# Altium project Juricic_Ivan.PrjPcb
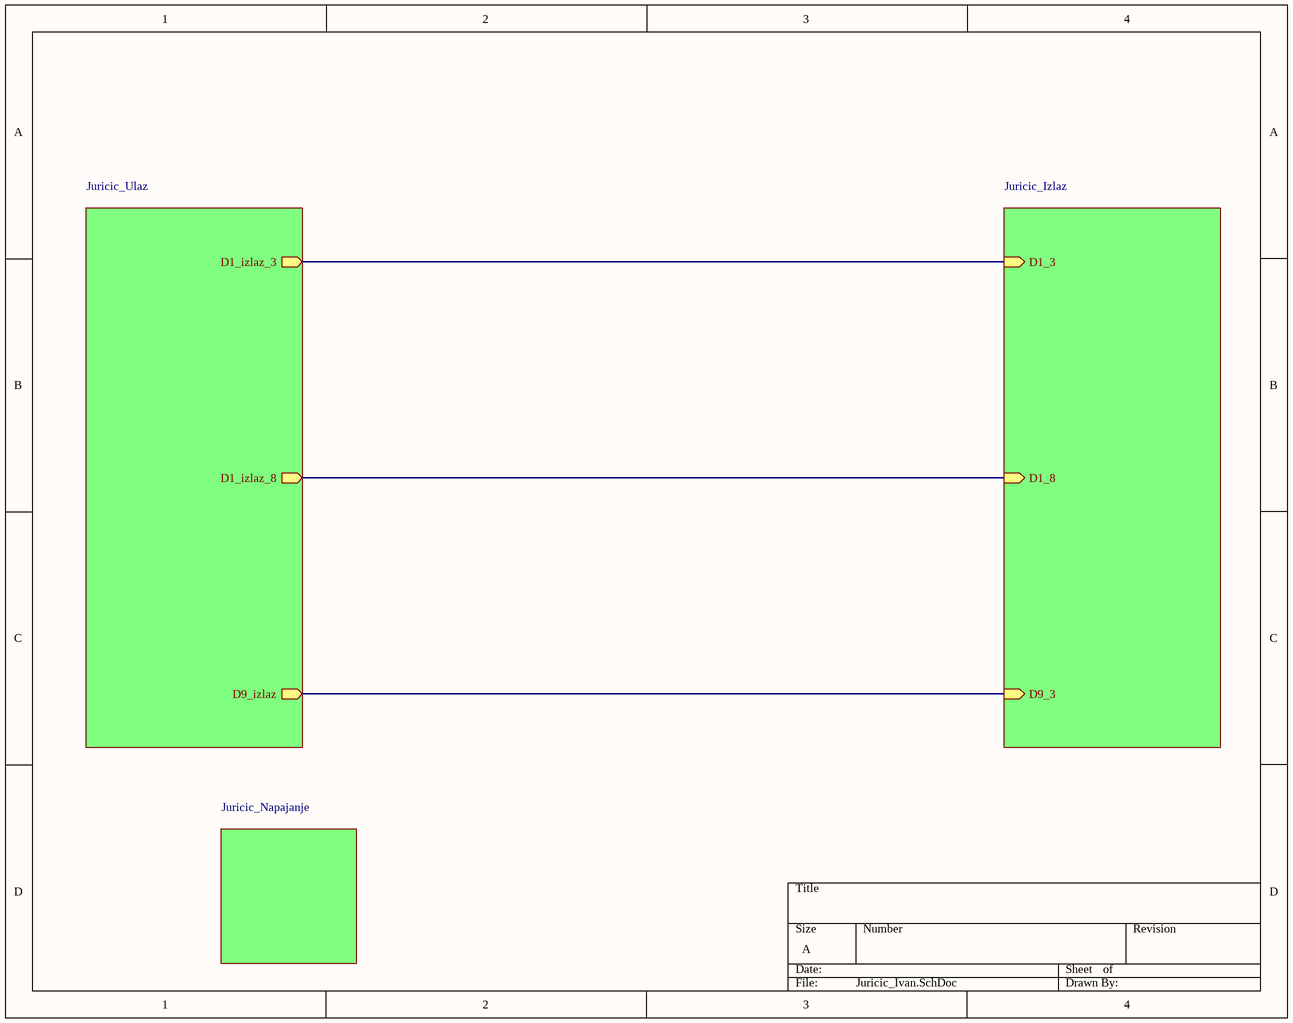
[diagram p0: Juricic_Ivan.SchDoc]
4 sheets, 59 parts. Net scope: hierarchical (ports join the sheet entries above them; power ports are global).
Board file: Juricic_Ivan.PcbDoc
Sheets:
  Juricic_Ivan.SchDoc
    Juricic_Ulaz = Juricic_Ulaz.SchDoc
    Juricic_Izlaz = Juricic_Izlaz.SchDoc
    Juricic_Napajanje = Juricic_Napajanje.SchDoc

## Sheet Juricic_Ivan.SchDoc
size A

### Sub-sheets
Juricic_Izlaz = Juricic_Izlaz: D1_3 (in), D1_8 (in), D9_3 (in)
Juricic_Napajanje = Juricic_Napajanje: no entries
Juricic_Ulaz = Juricic_Ulaz: D9_izlaz (out), D1_izlaz_8 (out), D1_izlaz_3 (out)

### Nets
D1_8: sheet Juricic_Ulaz/D1_izlaz_8, sheet Juricic_Izlaz/D1_8
D9_3: sheet Juricic_Ulaz/D9_izlaz, sheet Juricic_Izlaz/D9_3
NetD1_3: sheet Juricic_Ulaz/D1_izlaz_3, sheet Juricic_Izlaz/D1_3

## Sheet Juricic_Ulaz.SchDoc
size A
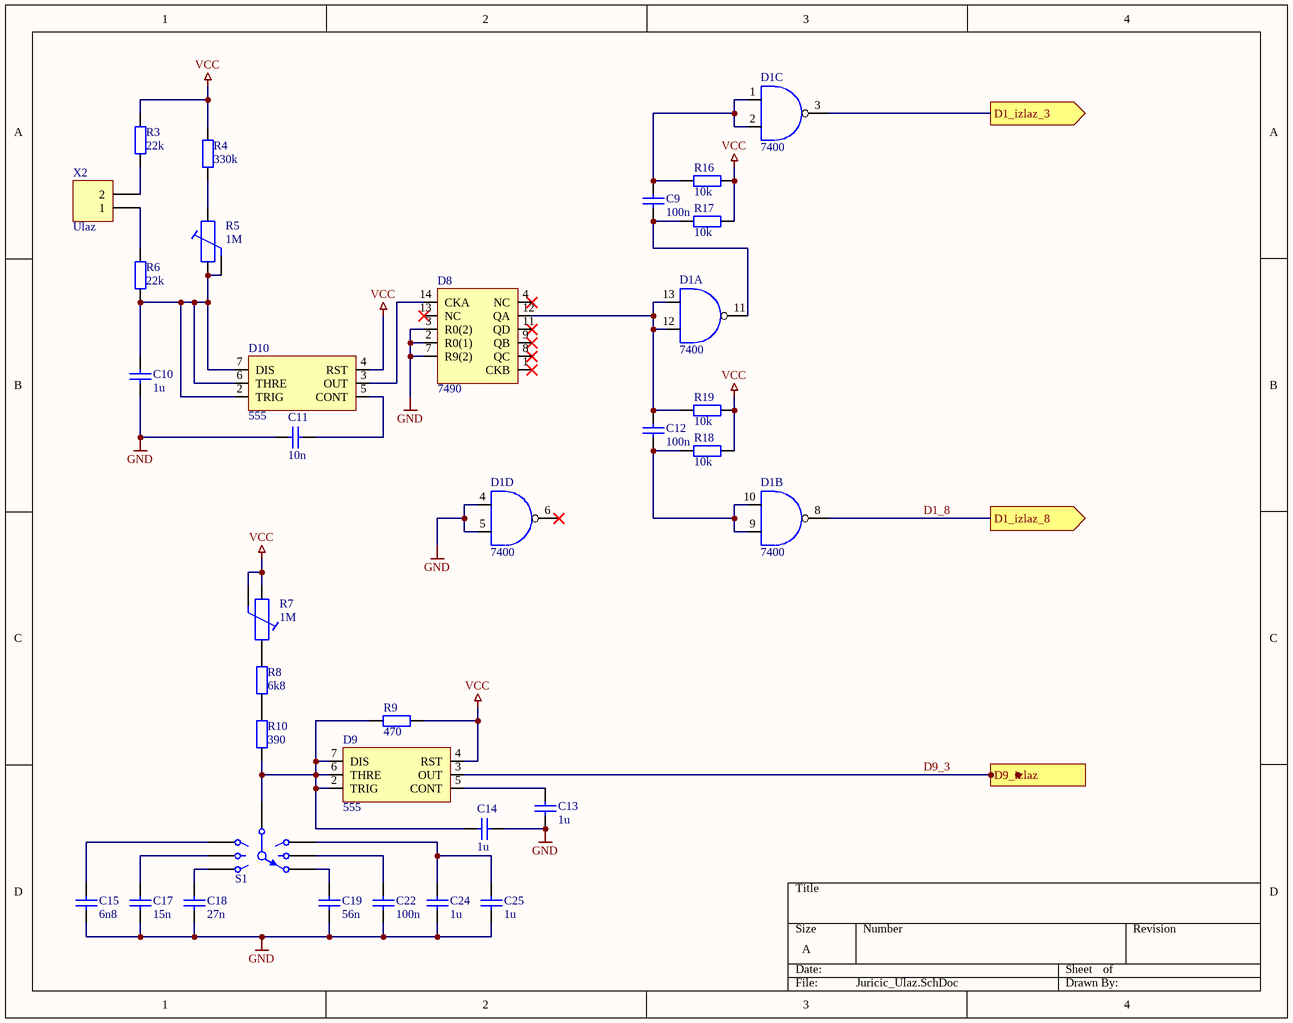
[diagram p1: Juricic_Ulaz.SchDoc]

### Parts
C9  100n  [C0805]
C10  1u  [C0805]
C11  10n  [C0805]
C12  100n  [C0805]
C13  1u  [C0805]
C14  1u  [C0805]
C15  6n8  [C0805]
C17  15n  [C0805]
C18  27n  [C0805]
C19  56n  [C0805]
C22  100n  [C0805]
C24  1u  [C0805]
C25  1u  [C0805]
D1  7400  [DIP-14]  (parts A,B,C,D of 4)
D8  7490  [DIP-14]
D9  555  [DIP-8]
D10  555  [DIP-8]
R3  22k  [AXIAL-0.4]
R4  330k  [AXIAL-0.4]
R5  1M  [Trimmer]
R6  22k  [AXIAL-0.4]
R7  1M  [Trimmer]
R8  6k8  [AXIAL-0.4]
R9  470  [AXIAL-0.4]
R10  390  [AXIAL-0.4]
R16  10k  [AXIAL-0.4]
R17  10k  [AXIAL-0.4]
R18  10k  [AXIAL-0.4]
R19  10k  [AXIAL-0.4]
S1  SW-6WAY  [SW-7]  (value not drawn)
X2  Ulaz  [HDR1X2]

### Ports
D1_izlaz_3 (out), D1_izlaz_8 (out), D9_izlaz (out)

### Nets
GND: C10.1 C11.2 C13.2 C14.1 C15.1 C17.1 C18.1 C19.1 C22.1 C24.1 C25.1 D1.4 D1.5 D8.2(R0(1)) D8.3(R0(2)) D8.7(R9(2))
VCC: D9.4(RST) D10.4(RST) R3.2 R4.2 R7.2 R7.3 R9.2 R16.2 R17.2 R18.2 R19.2
D1_8: D1.8 ; port D1_izlaz_8
D9_3: D9.3(OUT) ; port D9_izlaz
NetC9_1: C9.1 D1.11 R17.1
NetC9_2: C9.2 D1.1 D1.2 R16.1
NetC10_2: C10.2 D10.2(TRIG) D10.6(THRE) D10.7(DIS) R5.2 R5.3 R6.2
NetC11_1: C11.1 D10.5(CONT)
NetC12_1: C12.1 D1.9 D1.10 R18.1
NetC12_2: C12.2 D1.12 D1.13 D8.12(QA) R19.1
NetC13_1: C13.1 D9.5(CONT)
NetC14_2: C14.2 D9.2(TRIG) D9.6(THRE) D9.7(DIS) R9.1 R10.2 S1.7
NetC15_2: C15.2 S1.1
NetC17_2: C17.2 S1.2
NetC18_2: C18.2 S1.3
NetC19_2: C19.2 S1.6
NetC22_2: C22.2 S1.5
NetC24_2: C24.2 C25.2 S1.4
NetD1_3: D1.3 ; port D1_izlaz_3
NetD8_14: D8.14(CKA) D10.3(OUT)
NetR3_1: R3.1 X2.2
NetR4_1: R4.1 R5.1
NetR6_1: R6.1 X2.1
NetR7_1: R7.1 R8.1
NetR8_2: R8.2 R10.1

Not connected (* = marked no-connect by the designer): D1 6(18)*; D8 1(CKB)* 4(NC)* 8(QC)* 9(QB)* 11(QD)* 13(NC)*

### Library data of the parts
C9 C12 C22 = Cap: 100n capacitor; Published: 8-Jun-2000; LatestRevisionDate: 17-Jul-2002; LatestRevisionNote: Re-released for DXP Platform.; PackageReference: RAD-0.3; Publisher: Altium Limited; PackageDescription: Radial Cap, Thru-Hole; 2 Leads; 0.3 in Pin Spacing
C10 C24 C25 = Cap: 1u capacitor; Published: 8-Jun-2000; LatestRevisionDate: 17-Jul-2002; LatestRevisionNote: Re-released for DXP Platform.; PackageReference: RAD-0.3; Publisher: Altium Limited; PackageDescription: Radial Cap, Thru-Hole; 2 Leads; 0.3 in Pin Spacing
C11 = Cap: 10n capacitor; Published: 8-Jun-2000; LatestRevisionDate: 17-Jul-2002; LatestRevisionNote: Re-released for DXP Platform.; PackageReference: RAD-0.3; Publisher: Altium Limited; PackageDescription: Radial Cap, Thru-Hole; 2 Leads; 0.3 in Pin Spacing
C13 C14 = Cap: 1u capacitor; Value: 100pF; Published: 8-Jun-2000; LatestRevisionDate: 17-Jul-2002; LatestRevisionNote: Re-released for DXP Platform.; PackageReference: RAD-0.3; Publisher: Altium Limited; PackageDescription: Radial Cap, Thru-Hole; 2 Leads; 0.3 in Pin Spacing
C15 = Cap: 6n8 capacitor; Published: 8-Jun-2000; LatestRevisionDate: 17-Jul-2002; LatestRevisionNote: Re-released for DXP Platform.; PackageReference: RAD-0.3; Publisher: Altium Limited; PackageDescription: Radial Cap, Thru-Hole; 2 Leads; 0.3 in Pin Spacing
C17 = Cap: 15n capacitor; Published: 8-Jun-2000; LatestRevisionDate: 17-Jul-2002; LatestRevisionNote: Re-released for DXP Platform.; PackageReference: RAD-0.3; Publisher: Altium Limited; PackageDescription: Radial Cap, Thru-Hole; 2 Leads; 0.3 in Pin Spacing
C18 = Cap: 27n capacitor; Published: 8-Jun-2000; LatestRevisionDate: 17-Jul-2002; LatestRevisionNote: Re-released for DXP Platform.; PackageReference: RAD-0.3; Publisher: Altium Limited; PackageDescription: Radial Cap, Thru-Hole; 2 Leads; 0.3 in Pin Spacing
C19 = Cap: 56n capacitor; Published: 8-Jun-2000; LatestRevisionDate: 17-Jul-2002; LatestRevisionNote: Re-released for DXP Platform.; PackageReference: RAD-0.3; Publisher: Altium Limited; PackageDescription: Radial Cap, Thru-Hole; 2 Leads; 0.3 in Pin Spacing
D1 = 7400: NI sklop; Cijena: 1.41; Kat. broj: 3119930; Dobavljač: Farnell
D8 = 7490: Dekadsko/binarno brojilo; Cijena: 1.33; Kat. broj: 1470790; Dobavljač: Farnell
D9 D10 = 555: Cijena: 0.689; Kat. broj: 3121211; Dobavljač: Farnell
  D10: Parameter 2: *; Parameter 3: *
R3 R6 = Res2: 22k resistor; Published: 8-Jun-2000; LatestRevisionDate: 17-Jul-2002; LatestRevisionNote: Re-released for DXP Platform.; PackageReference: AXIAL-0.4; Publisher: Altium Limited; PackageDescription: Axial Device, Thru-Hole; 2 Leads; 0.4 in Pin Spacing
R4 = Res2: 330k resistor; Published: 8-Jun-2000; LatestRevisionDate: 17-Jul-2002; LatestRevisionNote: Re-released for DXP Platform.; PackageReference: AXIAL-0.4; Publisher: Altium Limited; PackageDescription: Axial Device, Thru-Hole; 2 Leads; 0.4 in Pin Spacing
R5 R7 = Trimmer
R8 = Res2: 6k8 resistor; Published: 8-Jun-2000; LatestRevisionDate: 17-Jul-2002; LatestRevisionNote: Re-released for DXP Platform.; PackageReference: AXIAL-0.4; Publisher: Altium Limited; PackageDescription: Axial Device, Thru-Hole; 2 Leads; 0.4 in Pin Spacing
R9 = Res2: 470 resistor; Value: 1K; Published: 8-Jun-2000; LatestRevisionDate: 17-Jul-2002; LatestRevisionNote: Re-released for DXP Platform.; PackageReference: AXIAL-0.4; Publisher: Altium Limited; PackageDescription: Axial Device, Thru-Hole; 2 Leads; 0.4 in Pin Spacing
R10 = Res2: 390 resistor; Published: 8-Jun-2000; LatestRevisionDate: 17-Jul-2002; LatestRevisionNote: Re-released for DXP Platform.; PackageReference: AXIAL-0.4; Publisher: Altium Limited; PackageDescription: Axial Device, Thru-Hole; 2 Leads; 0.4 in Pin Spacing
R16-R18 = Res2: 10k resistor; Published: 8-Jun-2000; LatestRevisionDate: 17-Jul-2002; LatestRevisionNote: Re-released for DXP Platform.; PackageReference: AXIAL-0.4; Publisher: Altium Limited; PackageDescription: Axial Device, Thru-Hole; 2 Leads; 0.4 in Pin Spacing
R19 = Res2: 10k resistor; Value: 1K; Published: 8-Jun-2000; LatestRevisionDate: 17-Jul-2002; LatestRevisionNote: Re-released for DXP Platform.; PackageReference: AXIAL-0.4; Publisher: Altium Limited; PackageDescription: Axial Device, Thru-Hole; 2 Leads; 0.4 in Pin Spacing
S1 = SW-6WAY: 6 Way Switch; Published: 24-Mar-1999; LatestRevisionDate: 17-Jul-2002; LatestRevisionNote: Re-released for DXP Platform.; PackageReference: SW-7; Publisher: Altium Limited; PackageDescription: Switch; 7 Leads
X2 = Header 2: Header, 2-Pin; Kat. broj: 3417645; Cijena: 0.319; LatestRevisionDate: 17-Jul-2002; LatestRevisionNote: Re-released for DXP Platform.; Publisher: Altium Limited

## Sheet Juricic_Izlaz.SchDoc
size A
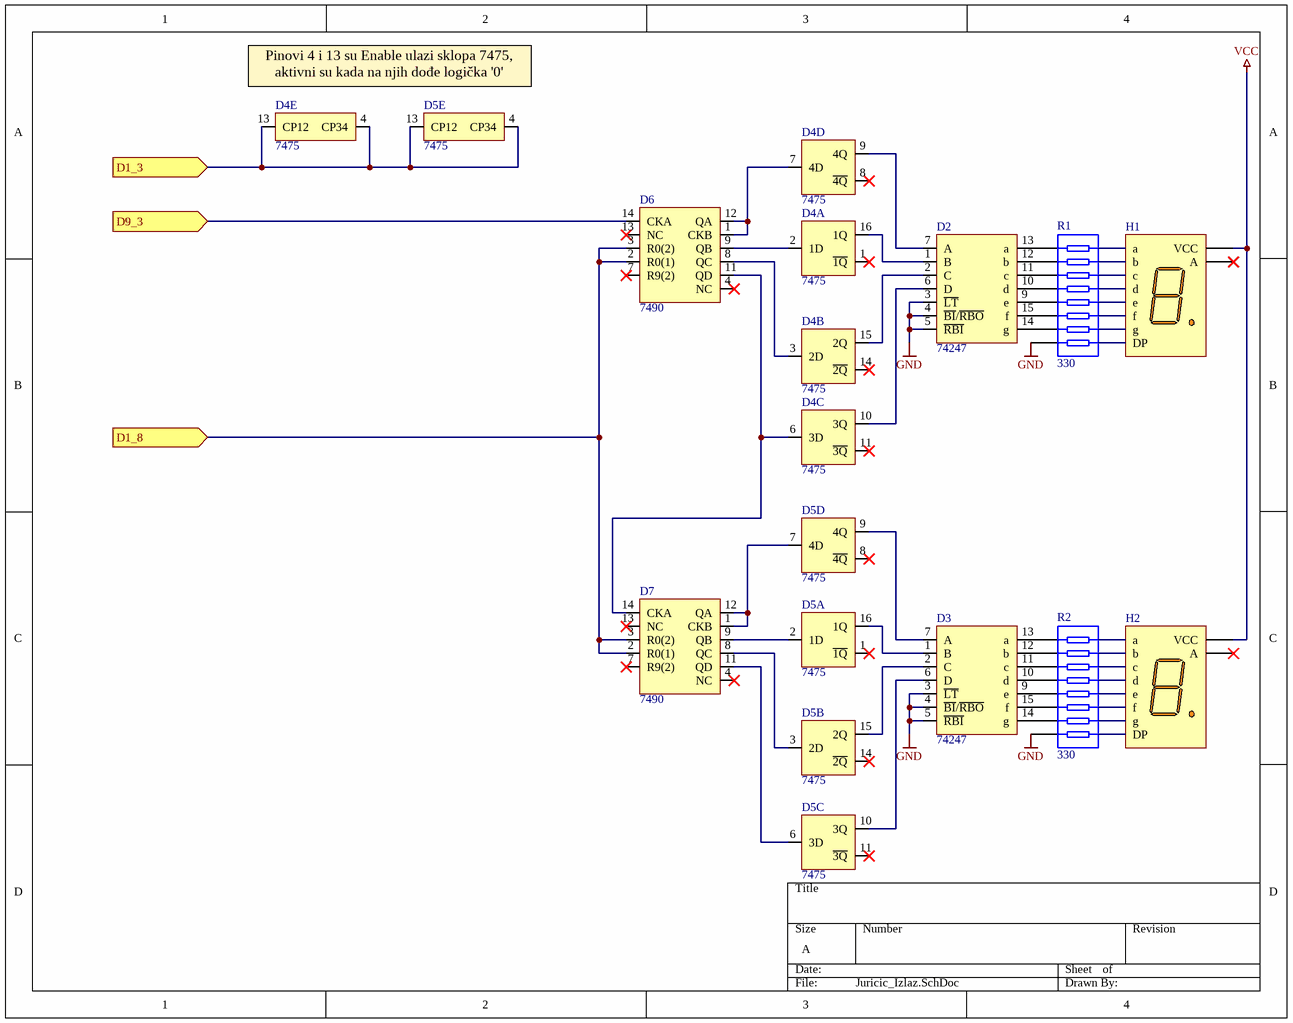
[diagram p2: Juricic_Izlaz.SchDoc]

### Parts
(Parts that share a designator on the sheet are numbered #1, #2 ... from top to bottom, then left to right.)
D2  74247  [DIP-16]
D3  74247  [DIP-16]
D4#1  7475  [DIP-16]  (part E of 5)
D4#2  7475  [DIP-16]  (parts A,B,C,D of 4)
D5#1  7475  [DIP-16]  (part E of 5)
D5#2  7475  [DIP-16]  (parts A,B,C,D of 4)
D6  7490  [DIP-14]
D7  7490  [DIP-14]
H1  Dpy Amber-CA  [A]  (value not drawn)
H2  Dpy Amber-CA  [A]  (value not drawn)
R1  330  [SSOP16_N]
R2  330  [SSOP16_N]

### Ports
D1_3 (in), D1_8 (in), D9_3 (in)

### Nets
GND: D2.3(~{LT}) D2.4(~{BI}/~{RBO}) D2.5(~{RBI}) D3.3(~{LT}) D3.4(~{BI}/~{RBO}) D3.5(~{RBI}) R1.8 R2.8
VCC: H1.1(VCC) H2.1(VCC)
D1_8: D6.2(R0(1)) D6.3(R0(2)) D7.2(R0(1)) D7.3(R0(2)) ; port D1_8
D9_3: D6.14(CKA) ; port D9_3
NetD1_3: D4#1.4(CP34) D4#1.13(CP12) D5#1.4(CP34) D5#1.13(CP12) ; port D1_3
NetD2_1: D2.1(B) D4#2.16(1Q)
NetD2_2: D2.2(C) D4#2.15(2Q)
NetD2_6: D2.6(D) D4#2.10(3Q)
NetD2_7: D2.7(A) D4#2.9(4Q)
NetD2_9: D2.9(e) R1.5
NetD2_10: D2.10(d) R1.4
NetD2_11: D2.11(c) R1.3
NetD2_12: D2.12(b) R1.2
NetD2_13: D2.13(a) R1.1
NetD2_14: D2.14(g) R1.7
NetD2_15: D2.15(f) R1.6
NetD3_1: D3.1(B) D5#2.16(1Q)
NetD3_2: D3.2(C) D5#2.15(2Q)
NetD3_6: D3.6(D) D5#2.10(3Q)
NetD3_7: D3.7(A) D5#2.9(4Q)
NetD3_9: D3.9(e) R2.5
NetD3_10: D3.10(d) R2.4
NetD3_11: D3.11(c) R2.3
NetD3_12: D3.12(b) R2.2
NetD3_13: D3.13(a) R2.1
NetD3_14: D3.14(g) R2.7
NetD3_15: D3.15(f) R2.6
NetD4#2_2: D4#2.2(1D) D6.9(QB)
NetD4#2_3: D4#2.3(2D) D6.8(QC)
NetD4#2_6: D4#2.6(3D) D6.11(QD) D7.14(CKA)
NetD4#2_7: D4#2.7(4D) D6.1(CKB) D6.12(QA)
NetD5#2_2: D5#2.2(1D) D7.9(QB)
NetD5#2_3: D5#2.3(2D) D7.8(QC)
NetD5#2_6: D5#2.6(3D) D7.11(QD)
NetD5#2_7: D5#2.7(4D) D7.1(CKB) D7.12(QA)
NetH1_2: H1.2(f) R1.11
NetH1_3: H1.3(g) R1.10
NetH1_4: H1.4(e) R1.12
NetH1_5: H1.5(d) R1.13
NetH1_7: H1.7(DP) R1.9
NetH1_8: H1.8(c) R1.14
NetH1_9: H1.9(b) R1.15
NetH1_10: H1.10(a) R1.16
NetH2_2: H2.2(f) R2.11
NetH2_3: H2.3(g) R2.10
NetH2_4: H2.4(e) R2.12
NetH2_5: H2.5(d) R2.13
NetH2_7: H2.7(DP) R2.9
NetH2_8: H2.8(c) R2.14
NetH2_9: H2.9(b) R2.15
NetH2_10: H2.10(a) R2.16

Not connected (* = marked no-connect by the designer): D4#2 1(~{1Q})* 8(~{4Q})* 11(~{3Q})* 14(~{2Q})*; D5#2 1(~{1Q})* 8(~{4Q})* 11(~{3Q})* 14(~{2Q})*; D6 4(NC)* 7(R9(2))* 13(NC)*; D7 4(NC)* 7(R9(2))* 13(NC)*; H1 6(A)*; H2 6(A)*

### Notes on the sheet
- Pinovi 4 i 13 su Enable ulazi sklopa 7475, aktivni su kada na njih dođe logička '0'

### Library data of the parts
D2 D3 = 74247: Dekoder BCD-a u 7-segmentni sklop; Cijena: 1.41; Kat. broj: 3119930; Dobavljač: Farnell; Tip: *
D4#1 D4#2 D5#1 D5#2 = 7475: 2-bitni CMOS bistabil; Cijena: 0.691; Kat. broj: CD74HC75E; Dobavljač: Farnell
D6 D7 = 7490: as D8 on sheet Juricic_Ulaz
H1 H2 = Dpy Amber-CA: 7.62 mm Black Surface Orange 7-Segment Display: CA, RH DP; MinimumIntensity: 354 ucd; Note: IF = 5 mA; Note: Pins 1 and 6 are redundant Anodes.; Published: 8-Jun-2000; LatestRevisionDate: 17-Dec-2003; LatestRevisionNote: Schematic revised, PCB Footprint replaced.; DatasheetVersion: 19-Feb-2002; PackageVersion: 11-Feb-2002; PackageReference: A; Publisher: Altium Limited; PackageDescription: LED, 7-Segment Display, 7.62 mm, RHD; 10 Leads; Row Space 5.08 mm; Pitch 2.54 mm; Colour: Orange; ComponentLink1Description: Manufacturer Link; ComponentLink1URL: http://www.agilent.com/
R1 = Res Pack4: 330 ohm, 8 resistor network; Cijena: 0.594; Kat. broj: 9356665; Dobavljač: Farnell; Published: 24-Mar-1999; LatestRevisionDate: 29-May-2009; LatestRevisionNote: IPC-7351 Footprint Added.; PackageVersion: Oct-2003; PackageReference: SSOP16; Publisher: Altium Limited; PackageDescription: 16-Pin Plastic Small Outline Package 0.65 mm Pitch; Code_JEDEC: MO-150-AC; Code_IPC: SOP65P780-16
R2 = Res Pack4: 330 ohm, 8 resistor network; Kat. broj: 9356665; Cijena: 0.594; Dobavljač: Farnell; Published: 24-Mar-1999; LatestRevisionDate: 29-May-2009; LatestRevisionNote: IPC-7351 Footprint Added.; PackageVersion: Oct-2003; PackageReference: SSOP16; Publisher: Altium Limited; PackageDescription: 16-Pin Plastic Small Outline Package 0.65 mm Pitch; Code_JEDEC: MO-150-AC; Code_IPC: SOP65P780-16

## Sheet Juricic_Napajanje.SchDoc
size A
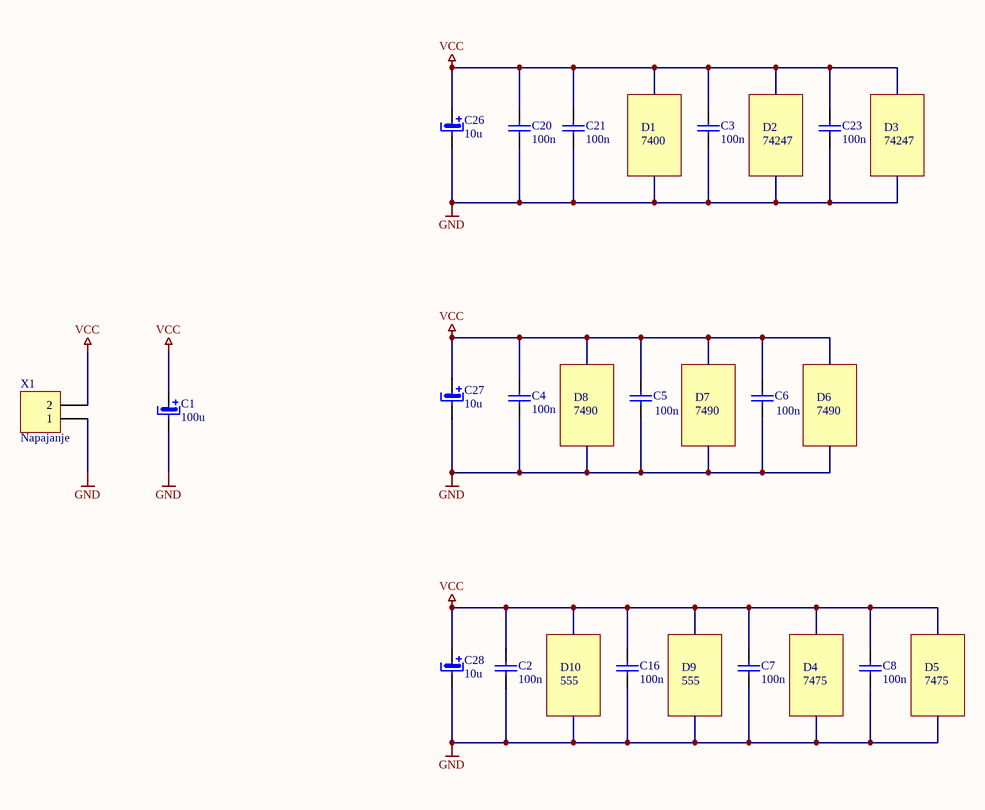
[diagram p3: Juricic_Napajanje.SchDoc]

### Parts
C1  100u  [CAPR5-4X5]
C2  100n  [C0805]
C3  100n  [C0805]
C4  100n  [C0805]
C5  100n  [C0805]
C6  100n  [C0805]
C7  100n  [C0805]
C8  100n  [C0805]
C16  100n  [C0805]
C20  100n  [C0805]
C21  100n  [C0805]
C23  100n  [C0805]
C26  10u  [CAPR5-4X5]
C27  10u  [CAPR5-4X5]
C28  10u  [CAPR5-4X5]
X1  Napajanje  [HDR1X2]

### Nets
GND: C1.2 C2.1 C3.1 C4.1 C5.1 C6.1 C7.1 C8.1 C16.1 C20.1 C21.1 C23.1 C26.2 C27.2 C28.2 X1.1
VCC: C1.1 C2.2 C3.2 C4.2 C5.2 C6.2 C7.2 C8.2 C16.2 C20.2 C21.2 C23.2 C26.1 C27.1 C28.1 X1.2

### Notes on the sheet
- D1
- 7400
- D2
- 74247
- D3
- D8
- 7490
- D7
- D6
- D10
- 555
- D9
- D4
- 7475
- D5

### Library data of the parts
C1 = Elko: 100u capacitor; Cijena: 0.299; Dobavljač: Farnell; Kat. broj: 1219466
C2-C8 C16 C20 C21 C23 = Cap: 100n capacitor; Kat. broj: 1759122; Cijena: 0.0233; Published: 8-Jun-2000; LatestRevisionDate: 17-Jul-2002; LatestRevisionNote: Re-released for DXP Platform.; PackageReference: RAD-0.3; Publisher: Altium Limited; PackageDescription: Radial Cap, Thru-Hole; 2 Leads; 0.3 in Pin Spacing
C26-C28 = Elko: 10u capacitor; Cijena: 0.214; Kat. broj: 1457413; Dobavljač: Farnell
X1 = Header 2: as X2 on sheet Juricic_Ulaz; LatestRevisionDate: 17-Jul-2002; LatestRevisionNote: Re-released for DXP Platform.; Publisher: Altium Limited

## Nets that join several sheets
GND: Juricic_Ulaz (16 pins), Juricic_Izlaz (8 pins), Juricic_Napajanje (16 pins)
VCC: Juricic_Ulaz (11 pins), Juricic_Izlaz (H1.1 H2.1), Juricic_Napajanje (16 pins)
D1_8: Juricic_Ulaz (D1.8), Juricic_Izlaz (D6.2 D6.3 D7.2 D7.3)
D9_3: Juricic_Ulaz (D9.3), Juricic_Izlaz (D6.14)
NetD1_3: Juricic_Ulaz (D1.3), Juricic_Izlaz (D4#1.4 D4#1.13 D5#1.4 D5#1.13)